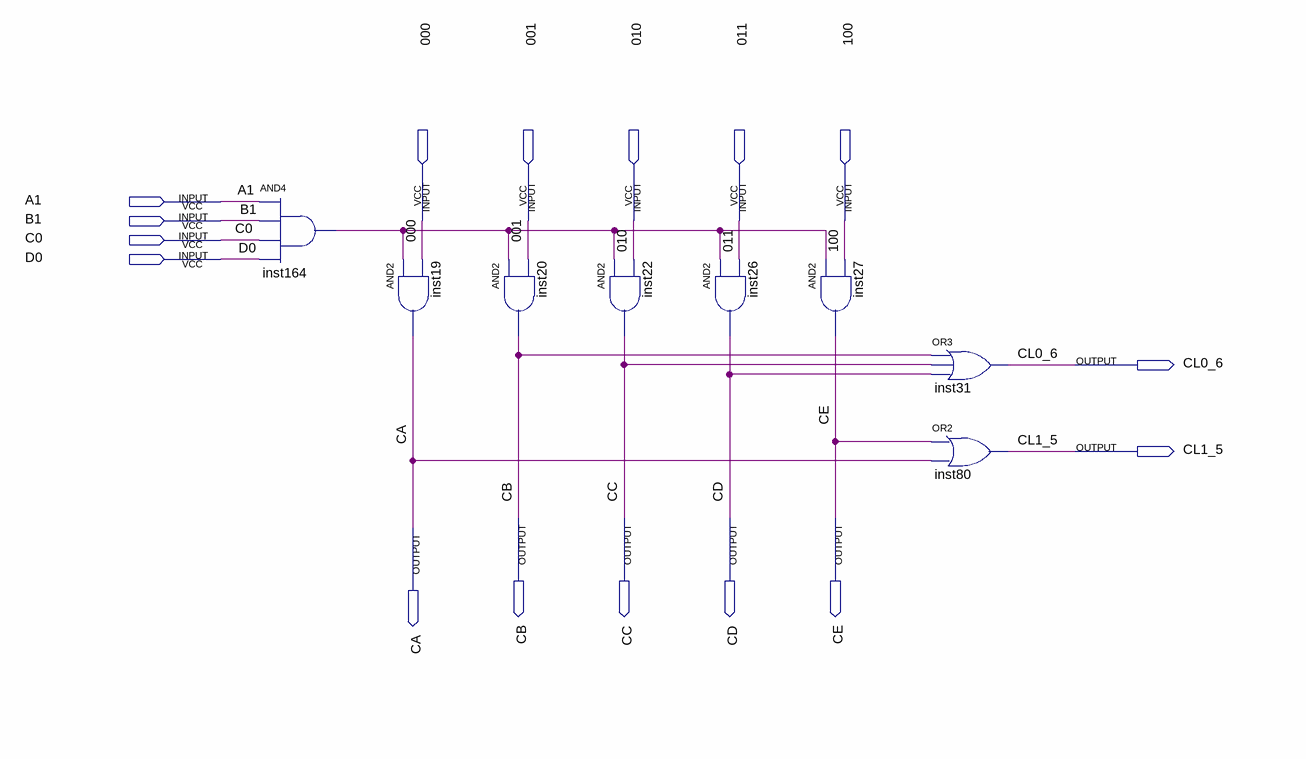
[diagram p0: schematic sheet]
// Quartus schematic caracC.bdf as structural Verilog: 8 symbols, 16 pins
module caracC (
  input  A1,
  input  B1,
  input  \000 ,
  input  \001 ,
  input  \010 ,
  input  \011 ,
  input  \100 ,
  input  C0,
  input  D0,
  output CL0_6,
  output CL1_5,
  output CB,
  output CC,
  output CD,
  output CE,
  output CA
);

  wire inst164_out;

  and inst164 (inst164_out, A1, B1, C0, D0);
  and inst19 (CA, inst164_out, \000 );
  and inst20 (CB, inst164_out, \001 );
  and inst22 (CC, inst164_out, \010 );
  and inst26 (CD, inst164_out, \011 );
  and inst27 (CE, inst164_out, \100 );
  or inst31 (CL0_6, CB, CC, CD);
  or inst80 (CL1_5, CE, CA);
endmodule
